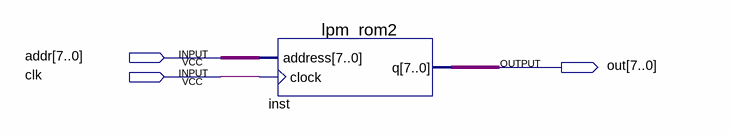
[diagram p0: schematic sheet]
// Quartus schematic test.bdf as structural Verilog: 1 symbols, 3 pins
module test (
  input  [7:0] addr,
  input  clk,
  output [7:0] out
);

  lpm_rom2 inst (.address(addr), .clock(clk), .q(out));
endmodule
